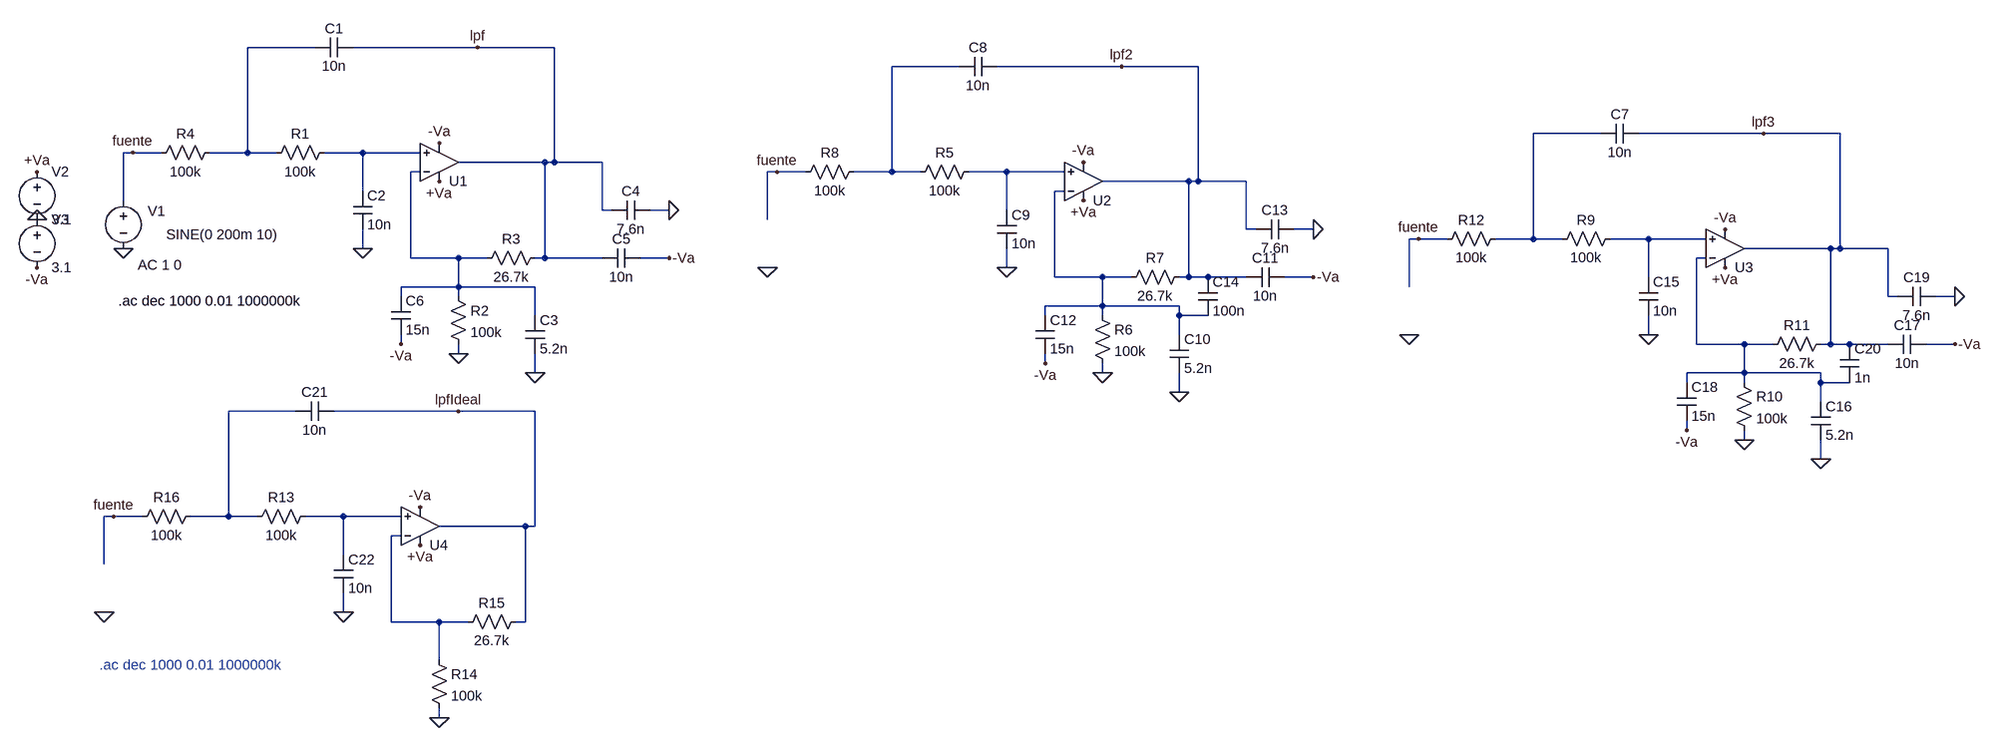
[diagram p0: schematic Prueba_Correcciones_LPF.asc]
Prueba_Correcciones_LPF.asc, the LTspice schematic file:
Version 4
SHEET 1 2872 1156
WIRE 64 -32 -48 -32
WIRE 336 -32 128 -32
WIRE 464 -32 336 -32
WIRE 1152 0 1040 0
WIRE 1424 0 1216 0
WIRE 1552 0 1424 0
WIRE 2224 112 2112 112
WIRE 2496 112 2288 112
WIRE 2624 112 2496 112
WIRE -240 144 -256 144
WIRE -192 144 -240 144
WIRE -48 144 -48 -32
WIRE -48 144 -112 144
WIRE 0 144 -48 144
WIRE 144 144 80 144
WIRE 240 144 144 144
WIRE 448 160 304 160
WIRE 464 160 464 -32
WIRE 464 160 448 160
WIRE 544 160 464 160
WIRE 240 176 224 176
WIRE 848 176 832 176
WIRE 896 176 848 176
WIRE 1040 176 1040 0
WIRE 1040 176 976 176
WIRE 1088 176 1040 176
WIRE 1232 176 1168 176
WIRE 1328 176 1232 176
WIRE 1536 192 1392 192
WIRE 1552 192 1552 0
WIRE 1552 192 1536 192
WIRE 1632 192 1552 192
WIRE 144 208 144 144
WIRE 1328 208 1312 208
WIRE -256 224 -256 144
WIRE 544 240 544 160
WIRE 560 240 544 240
WIRE 656 240 624 240
WIRE 1232 240 1232 176
WIRE 832 256 832 176
WIRE 1632 272 1632 192
WIRE 1648 272 1632 272
WIRE 1744 272 1712 272
WIRE 1920 288 1904 288
WIRE 1968 288 1920 288
WIRE 2112 288 2112 112
WIRE 2112 288 2048 288
WIRE 2160 288 2112 288
WIRE 2304 288 2240 288
WIRE 2400 288 2304 288
WIRE 144 304 144 272
WIRE 2608 304 2464 304
WIRE 2624 304 2624 112
WIRE 2624 304 2608 304
WIRE 2704 304 2624 304
WIRE 224 320 224 176
WIRE 304 320 224 320
WIRE 352 320 304 320
WIRE 448 320 448 160
WIRE 448 320 432 320
WIRE 544 320 448 320
WIRE 656 320 608 320
WIRE 2400 320 2384 320
WIRE 1232 336 1232 304
WIRE 1312 352 1312 208
WIRE 1392 352 1312 352
WIRE 1440 352 1392 352
WIRE 1536 352 1536 192
WIRE 1536 352 1520 352
WIRE 1568 352 1536 352
WIRE 1632 352 1568 352
WIRE 1744 352 1696 352
WIRE 2304 352 2304 288
WIRE 304 368 304 320
WIRE 304 368 208 368
WIRE 432 368 304 368
WIRE 1904 368 1904 288
WIRE 208 384 208 368
WIRE 304 384 304 368
WIRE 2704 384 2704 304
WIRE 2720 384 2704 384
WIRE 2816 384 2784 384
WIRE 1392 400 1392 352
WIRE 1392 400 1296 400
WIRE 1520 400 1392 400
WIRE 432 416 432 368
WIRE 1296 416 1296 400
WIRE 1392 416 1392 400
WIRE 1520 416 1520 400
WIRE 1568 416 1520 416
WIRE 1520 448 1520 416
WIRE 2304 448 2304 416
WIRE 208 464 208 448
WIRE 2384 464 2384 320
WIRE 2464 464 2384 464
WIRE 2512 464 2464 464
WIRE 2608 464 2608 304
WIRE 2608 464 2592 464
WIRE 2640 464 2608 464
WIRE 2704 464 2640 464
WIRE 2816 464 2768 464
WIRE 304 480 304 464
WIRE 1296 496 1296 480
WIRE 432 512 432 480
WIRE 1392 512 1392 496
WIRE 2464 512 2464 464
WIRE 2464 512 2368 512
WIRE 2592 512 2464 512
WIRE 2368 528 2368 512
WIRE 2464 528 2464 512
WIRE 2592 528 2592 512
WIRE 2640 528 2592 528
WIRE 1520 544 1520 512
WIRE 2592 560 2592 528
WIRE 32 576 -80 576
WIRE 304 576 96 576
WIRE 432 576 304 576
WIRE 2368 608 2368 592
WIRE 2464 624 2464 608
WIRE 2592 656 2592 624
WIRE -272 752 -288 752
WIRE -224 752 -272 752
WIRE -80 752 -80 576
WIRE -80 752 -144 752
WIRE -32 752 -80 752
WIRE 112 752 48 752
WIRE 208 752 112 752
WIRE 416 768 272 768
WIRE 432 768 432 576
WIRE 432 768 416 768
WIRE 208 784 192 784
WIRE 112 816 112 752
WIRE -288 832 -288 752
WIRE 112 912 112 880
WIRE 192 928 192 784
WIRE 272 928 192 928
WIRE 320 928 272 928
WIRE 416 928 416 768
WIRE 416 928 400 928
WIRE 272 992 272 928
WIRE 272 1088 272 1072
FLAG 272 192 +Va
FLAG 272 128 -Va
FLAG 144 304 0
FLAG 304 480 0
FLAG 336 -32 lpf
FLAG -256 304 0
FLAG -240 144 fuente
FLAG 432 512 0
FLAG -400 256 0
FLAG -400 176 +Va
FLAG -400 336 -Va
FLAG 656 320 -Va
FLAG 656 240 0
FLAG 208 464 -Va
FLAG 1360 224 +Va
FLAG 1360 160 -Va
FLAG 1232 336 0
FLAG 1392 512 0
FLAG 1424 0 lpf2
FLAG 832 336 0
FLAG 848 176 fuente
FLAG 1520 544 0
FLAG 1744 352 -Va
FLAG 1744 272 0
FLAG 1296 496 -Va
FLAG 2432 336 +Va
FLAG 2432 272 -Va
FLAG 2304 448 0
FLAG 2464 624 0
FLAG 2496 112 lpf3
FLAG 1904 448 0
FLAG 1920 288 fuente
FLAG 2592 656 0
FLAG 2816 464 -Va
FLAG 2816 384 0
FLAG 2368 608 -Va
FLAG 240 800 +Va
FLAG 240 736 -Va
FLAG 112 912 0
FLAG 272 1088 0
FLAG 304 576 lpfIdeal
FLAG -288 912 0
FLAG -272 752 fuente
SYMBOL res 96 128 R90
WINDOW 0 0 56 VBottom 2
WINDOW 3 32 56 VTop 2
SYMATTR InstName R1
SYMATTR Value 100k
SYMBOL cap 128 -48 R90
WINDOW 0 0 32 VBottom 2
WINDOW 3 32 32 VTop 2
SYMATTR InstName C1
SYMATTR Value 10n
SYMBOL cap 128 208 R0
SYMATTR InstName C2
SYMATTR Value 10n
SYMBOL OpAmps\\UniversalOpAmp2 272 160 M180
SYMATTR InstName U1
SYMBOL res 288 368 R0
SYMATTR InstName R2
SYMATTR Value 100k
SYMBOL res 448 304 R90
WINDOW 0 0 56 VBottom 2
WINDOW 3 32 56 VTop 2
SYMATTR InstName R3
SYMATTR Value 26.7k
SYMBOL voltage -256 208 R0
WINDOW 0 41 34 Left 2
WINDOW 123 24 124 Left 2
WINDOW 39 0 0 Left 0
WINDOW 3 72 73 Left 2
SYMATTR InstName V1
SYMATTR Value2 AC 1 0
SYMATTR Value SINE(0 200m 10)
SYMBOL cap 416 416 R0
SYMATTR InstName C3
SYMATTR Value 5.2n
SYMBOL voltage -400 160 R0
WINDOW 123 0 0 Left 0
WINDOW 39 0 0 Left 0
SYMATTR InstName V2
SYMATTR Value 3.1
SYMBOL voltage -400 240 R0
WINDOW 123 0 0 Left 0
WINDOW 39 0 0 Left 0
SYMATTR InstName V3
SYMATTR Value 3.1
SYMBOL cap 608 304 R90
WINDOW 0 0 32 VBottom 2
WINDOW 3 32 32 VTop 2
SYMATTR InstName C5
SYMATTR Value 10n
SYMBOL res -96 128 R90
WINDOW 0 0 56 VBottom 2
WINDOW 3 32 56 VTop 2
SYMATTR InstName R4
SYMATTR Value 100k
SYMBOL cap 192 384 R0
SYMATTR InstName C6
SYMATTR Value 15n
SYMBOL cap 624 224 R90
WINDOW 0 0 32 VBottom 2
WINDOW 3 32 32 VTop 2
SYMATTR InstName C4
SYMATTR Value 7.6n
SYMBOL res 1184 160 R90
WINDOW 0 0 56 VBottom 2
WINDOW 3 32 56 VTop 2
SYMATTR InstName R5
SYMATTR Value 100k
SYMBOL cap 1216 -16 R90
WINDOW 0 0 32 VBottom 2
WINDOW 3 32 32 VTop 2
SYMATTR InstName C8
SYMATTR Value 10n
SYMBOL cap 1216 240 R0
SYMATTR InstName C9
SYMATTR Value 10n
SYMBOL OpAmps\\UniversalOpAmp2 1360 192 M180
SYMATTR InstName U2
SYMBOL res 1376 400 R0
SYMATTR InstName R6
SYMATTR Value 100k
SYMBOL res 1536 336 R90
WINDOW 0 0 56 VBottom 2
WINDOW 3 32 56 VTop 2
SYMATTR InstName R7
SYMATTR Value 26.7k
SYMBOL cap 1504 448 R0
SYMATTR InstName C10
SYMATTR Value 5.2n
SYMBOL cap 1696 336 R90
WINDOW 0 0 32 VBottom 2
WINDOW 3 32 32 VTop 2
SYMATTR InstName C11
SYMATTR Value 10n
SYMBOL res 992 160 R90
WINDOW 0 0 56 VBottom 2
WINDOW 3 32 56 VTop 2
SYMATTR InstName R8
SYMATTR Value 100k
SYMBOL cap 1280 416 R0
SYMATTR InstName C12
SYMATTR Value 15n
SYMBOL cap 1712 256 R90
WINDOW 0 0 32 VBottom 2
WINDOW 3 32 32 VTop 2
SYMATTR InstName C13
SYMATTR Value 7.6n
SYMBOL cap 1552 352 R0
SYMATTR InstName C14
SYMATTR Value 100n
SYMBOL res 2256 272 R90
WINDOW 0 0 56 VBottom 2
WINDOW 3 32 56 VTop 2
SYMATTR InstName R9
SYMATTR Value 100k
SYMBOL cap 2288 96 R90
WINDOW 0 0 32 VBottom 2
WINDOW 3 32 32 VTop 2
SYMATTR InstName C7
SYMATTR Value 10n
SYMBOL cap 2288 352 R0
SYMATTR InstName C15
SYMATTR Value 10n
SYMBOL OpAmps\\UniversalOpAmp2 2432 304 M180
SYMATTR InstName U3
SYMBOL res 2448 512 R0
SYMATTR InstName R10
SYMATTR Value 100k
SYMBOL res 2608 448 R90
WINDOW 0 0 56 VBottom 2
WINDOW 3 32 56 VTop 2
SYMATTR InstName R11
SYMATTR Value 26.7k
SYMBOL cap 2576 560 R0
SYMATTR InstName C16
SYMATTR Value 5.2n
SYMBOL cap 2768 448 R90
WINDOW 0 0 32 VBottom 2
WINDOW 3 32 32 VTop 2
SYMATTR InstName C17
SYMATTR Value 10n
SYMBOL res 2064 272 R90
WINDOW 0 0 56 VBottom 2
WINDOW 3 32 56 VTop 2
SYMATTR InstName R12
SYMATTR Value 100k
SYMBOL cap 2352 528 R0
SYMATTR InstName C18
SYMATTR Value 15n
SYMBOL cap 2784 368 R90
WINDOW 0 0 32 VBottom 2
WINDOW 3 32 32 VTop 2
SYMATTR InstName C19
SYMATTR Value 7.6n
SYMBOL cap 2624 464 R0
SYMATTR InstName C20
SYMATTR Value 1n
SYMBOL res 64 736 R90
WINDOW 0 0 56 VBottom 2
WINDOW 3 32 56 VTop 2
SYMATTR InstName R13
SYMATTR Value 100k
SYMBOL cap 96 560 R90
WINDOW 0 0 32 VBottom 2
WINDOW 3 32 32 VTop 2
SYMATTR InstName C21
SYMATTR Value 10n
SYMBOL cap 96 816 R0
SYMATTR InstName C22
SYMATTR Value 10n
SYMBOL OpAmps\\UniversalOpAmp2 240 768 M180
SYMATTR InstName U4
SYMBOL res 256 976 R0
SYMATTR InstName R14
SYMATTR Value 100k
SYMBOL res 416 912 R90
WINDOW 0 0 56 VBottom 2
WINDOW 3 32 56 VTop 2
SYMATTR InstName R15
SYMATTR Value 26.7k
SYMBOL res -128 736 R90
WINDOW 0 0 56 VBottom 2
WINDOW 3 32 56 VTop 2
SYMATTR InstName R16
SYMATTR Value 100k
TEXT -264 392 Left 2 !.ac dec 1000 0.01 1000000k
TEXT -296 1000 Left 2 ;.ac dec 1000 0.01 1000000k

The netlist it stands for:
* Prueba_Correcciones_LPF.asc
R1 N004 N001 100k
C1 lpf N001 10n
C2 N004 0 10n
XU1 N004 N005 +Va -Va lpf level2 Avol=1Meg GBW=10Meg Slew=10Meg Ilimit=25m Rail=0 Vos=0 En=0 Enk=0 In=0 Ink=0 Rin=500Meg  ; pins In+ In- V+ V- OUT
R2 N005 0 100k
R3 lpf N005 26.7k
V1 fuente 0 SINE(0 200m 10) AC 1 0
C3 N005 0 5.2n
V2 +Va 0 3.1
V3 0 -Va 3.1
C5 -Va lpf 10n
R4 N001 fuente 100k
C6 N005 -Va 15n
C4 0 lpf 7.6n
R5 N006 N002 100k
C8 lpf2 N002 10n
C9 N006 0 10n
XU2 N006 N007 +Va -Va lpf2 level2 Avol=1Meg GBW=10Meg Slew=10Meg Ilimit=25m Rail=0 Vos=0 En=0 Enk=0 In=0 Ink=0 Rin=500Meg  ; pins In+ In- V+ V- OUT
R6 N007 0 100k
R7 lpf2 N007 26.7k
C10 N007 0 5.2n
C11 -Va lpf2 10n
R8 N002 fuente 100k
C12 N007 -Va 15n
C13 0 lpf2 7.6n
C14 lpf2 N007 100n
R9 N008 N003 100k
C7 lpf3 N003 10n
C15 N008 0 10n
XU3 N008 N009 +Va -Va lpf3 level2 Avol=1Meg GBW=10Meg Slew=10Meg Ilimit=25m Rail=0 Vos=0 En=0 Enk=0 In=0 Ink=0 Rin=500Meg  ; pins In+ In- V+ V- OUT
R10 N009 0 100k
R11 lpf3 N009 26.7k
C16 N009 0 5.2n
C17 -Va lpf3 10n
R12 N003 fuente 100k
C18 N009 -Va 15n
C19 0 lpf3 7.6n
C20 lpf3 N009 1n
R13 N011 N010 100k
C21 lpfIdeal N010 10n
C22 N011 0 10n
XU4 N011 N012 +Va -Va lpfIdeal level2 Avol=1Meg GBW=10Meg Slew=10Meg Ilimit=25m Rail=0 Vos=0 En=0 Enk=0 In=0 Ink=0 Rin=500Meg  ; pins In+ In- V+ V- OUT
R14 N012 0 100k
R15 lpfIdeal N012 26.7k
R16 N010 fuente 100k
.ac dec 1000 0.01 1000000k
* .ac dec 1000 0.01 1000000k
.lib UniversalOpAmp2.lib
.backanno
.end